# Altium schematic sheet 0172_IMVP VCCCORE_SOC_ .SchDoc
size 848 x 558 mm
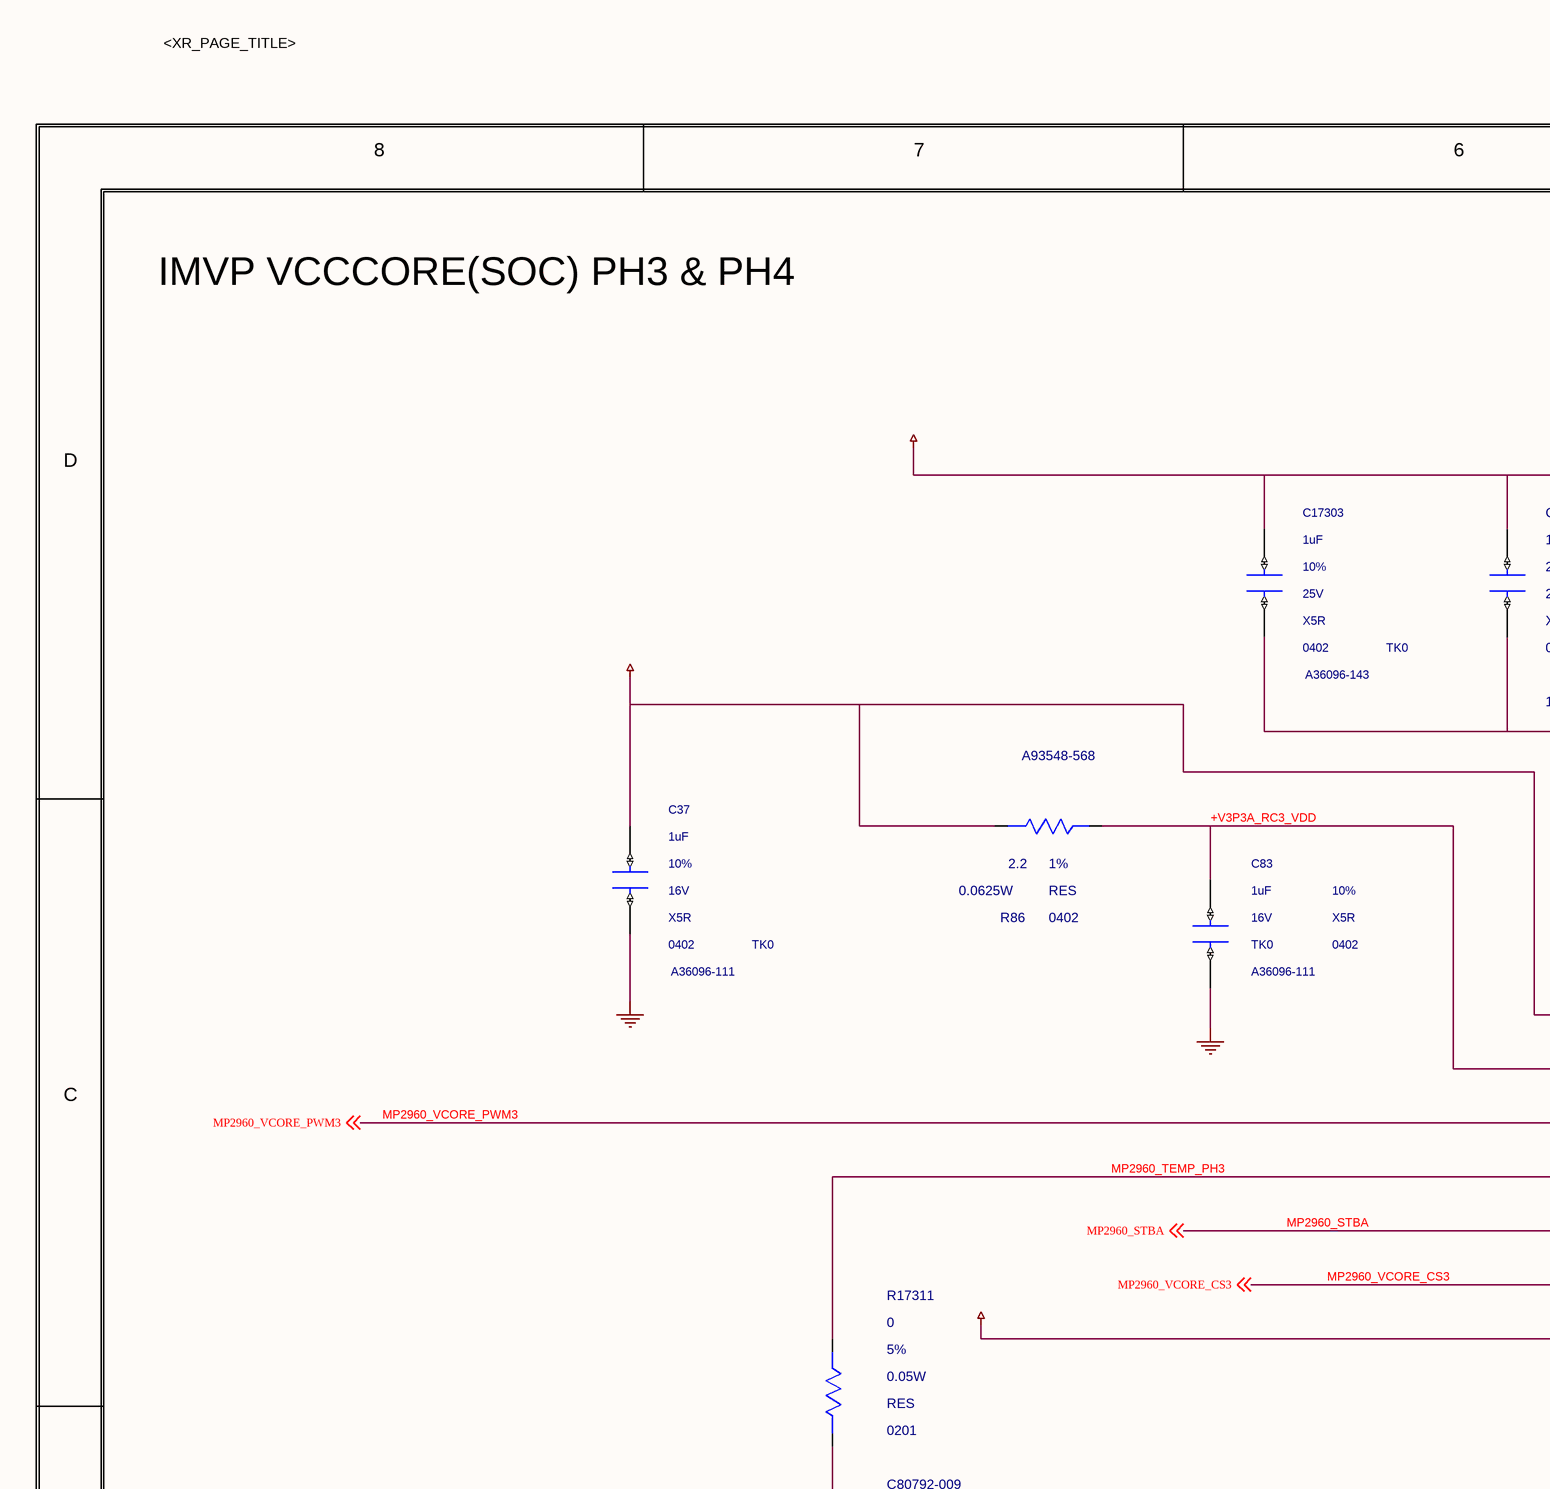
[diagram p0: 0172_IMVP VCCCORE_SOC_ .SchDoc, top left]
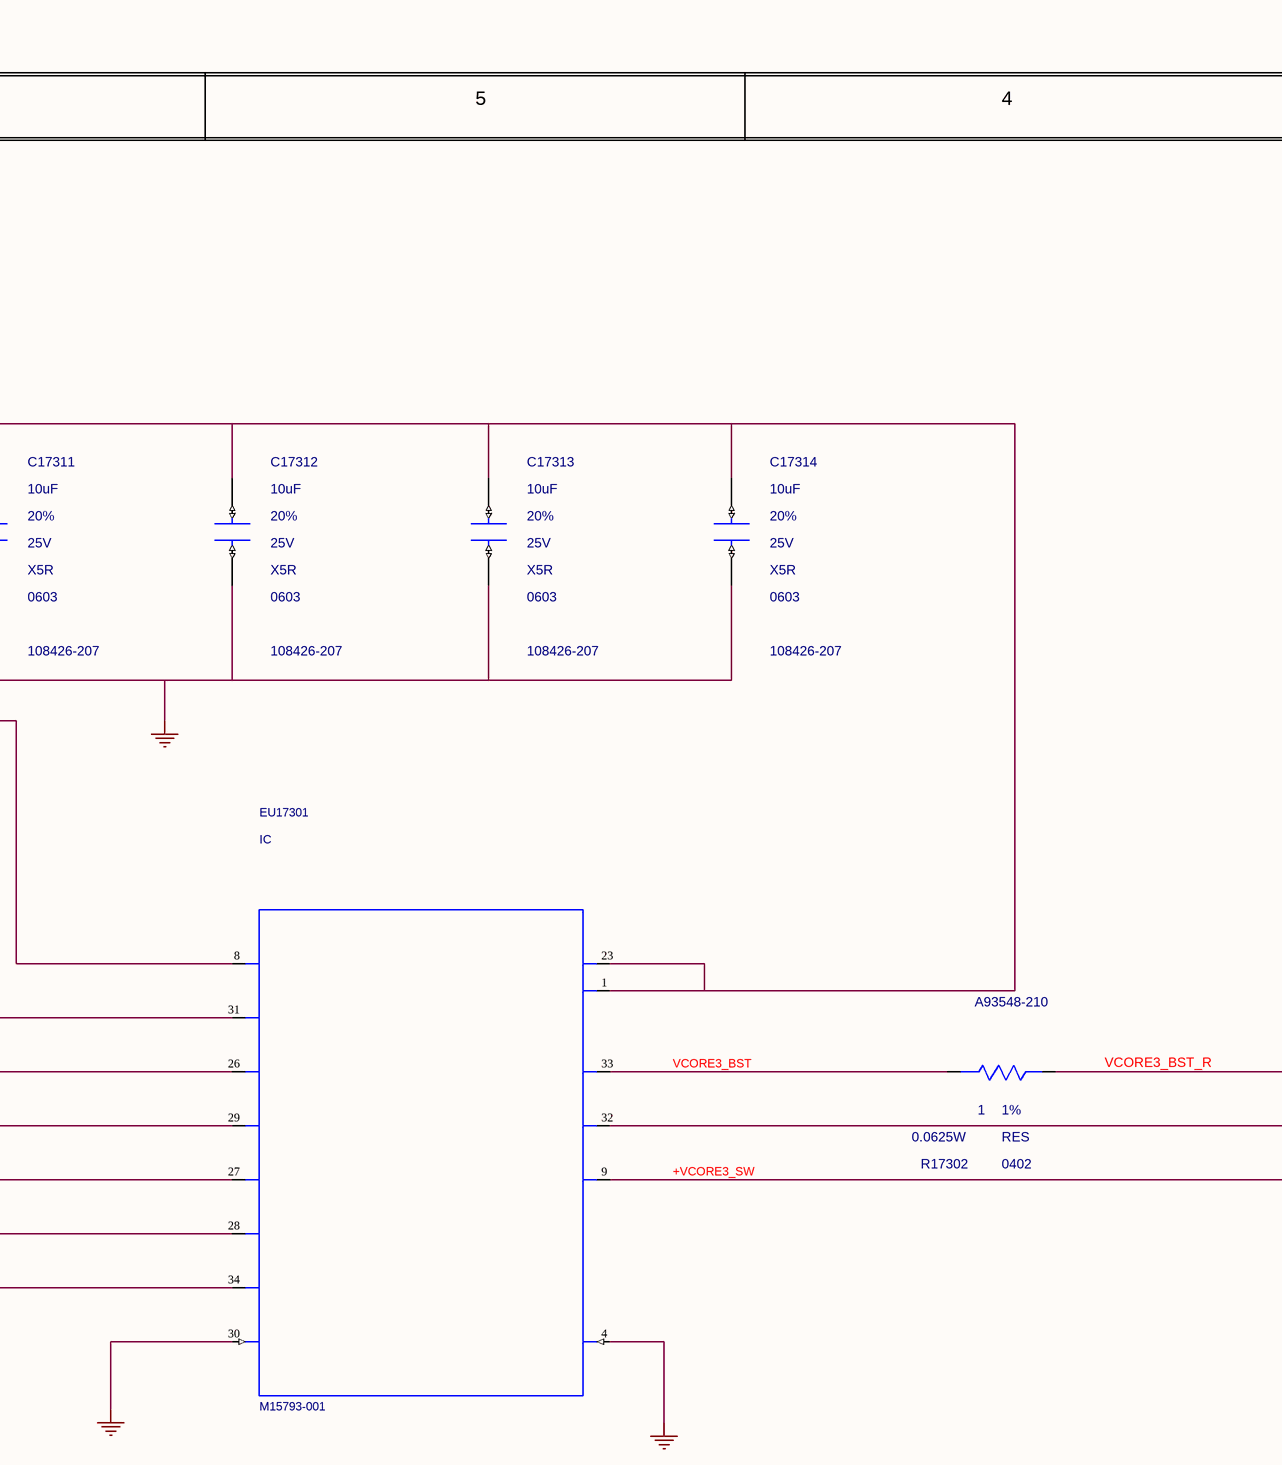
[diagram p1: 0172_IMVP VCCCORE_SOC_ .SchDoc, top middle]
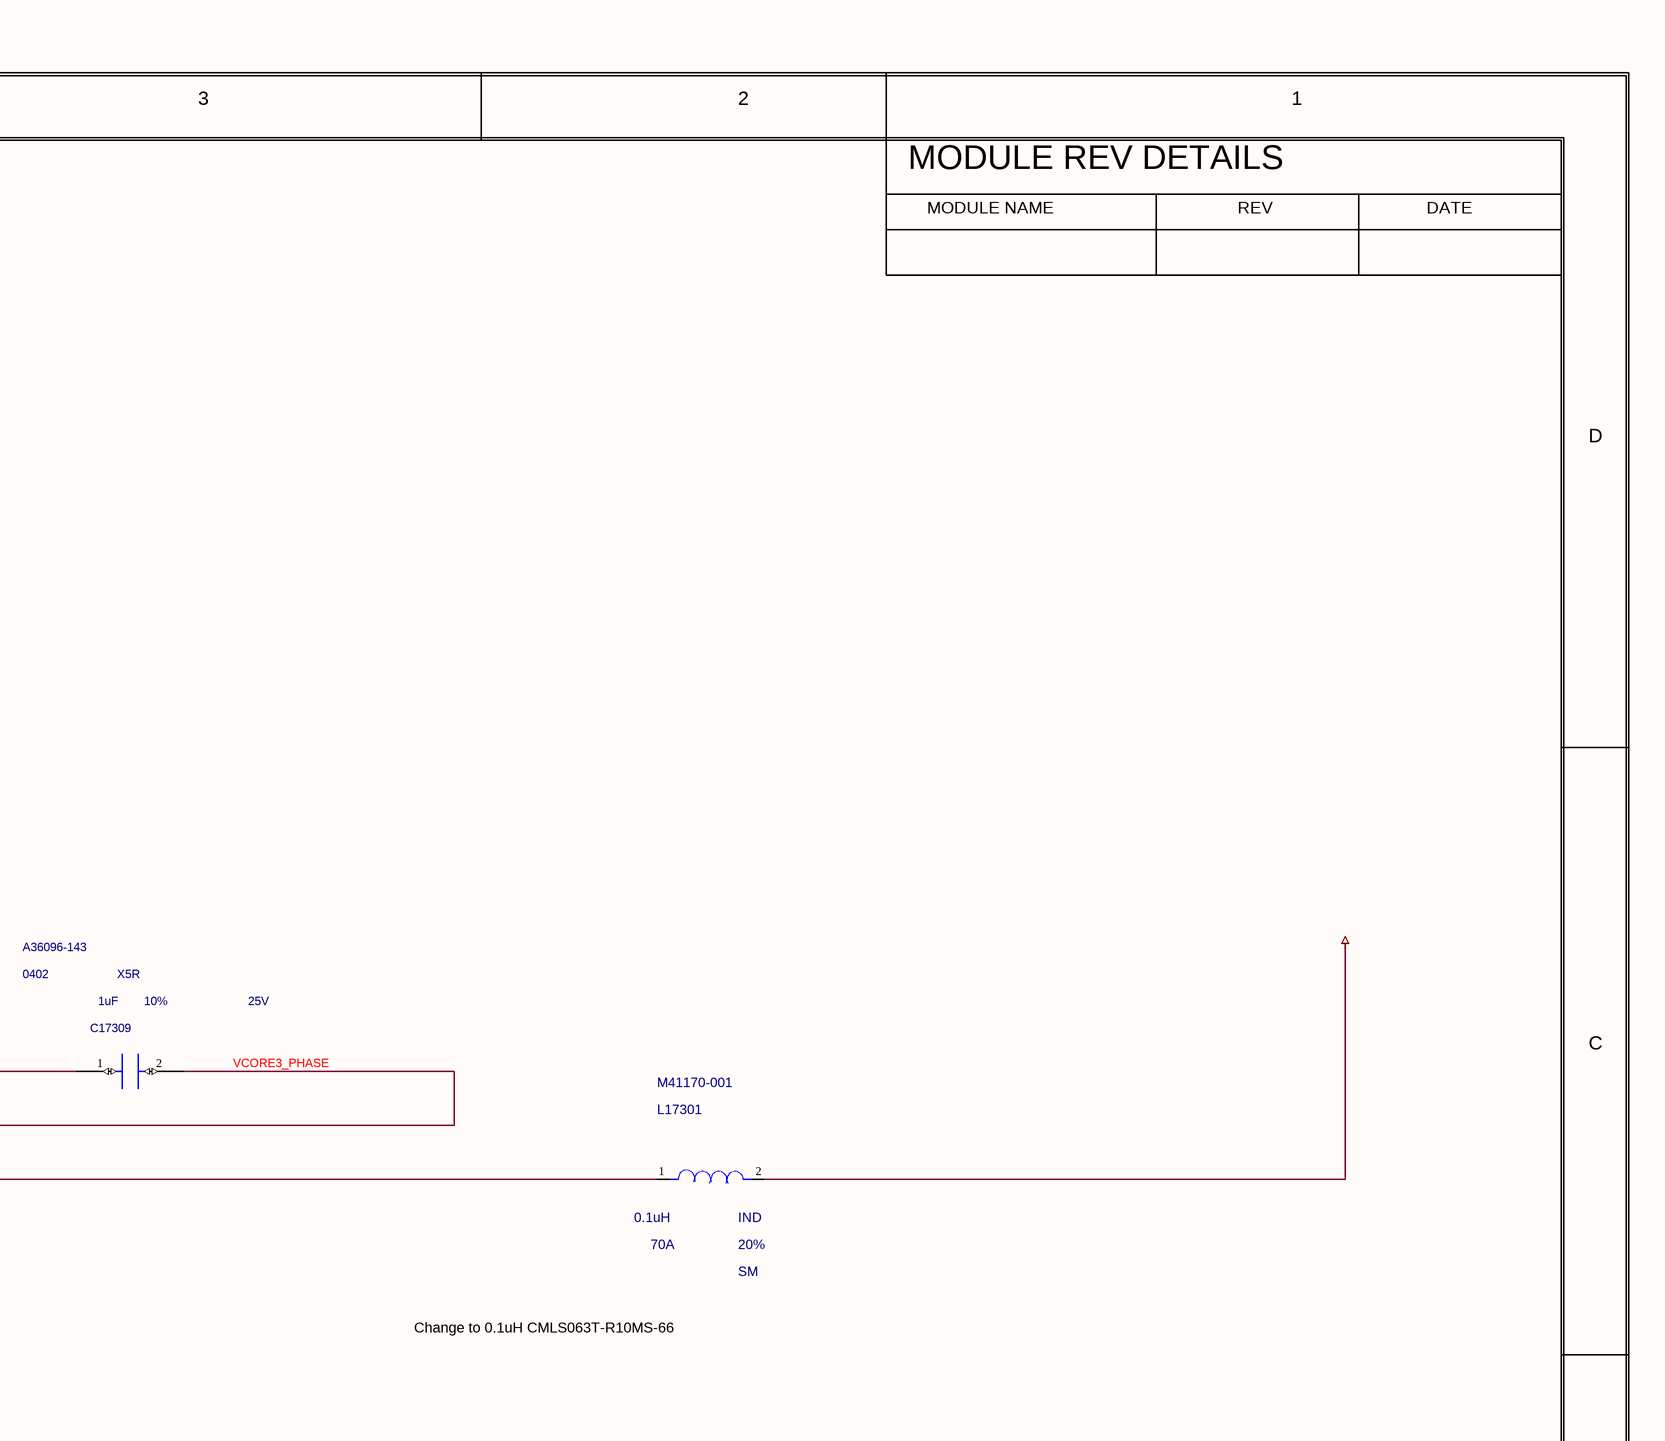
[diagram p2: 0172_IMVP VCCCORE_SOC_ .SchDoc, top right]
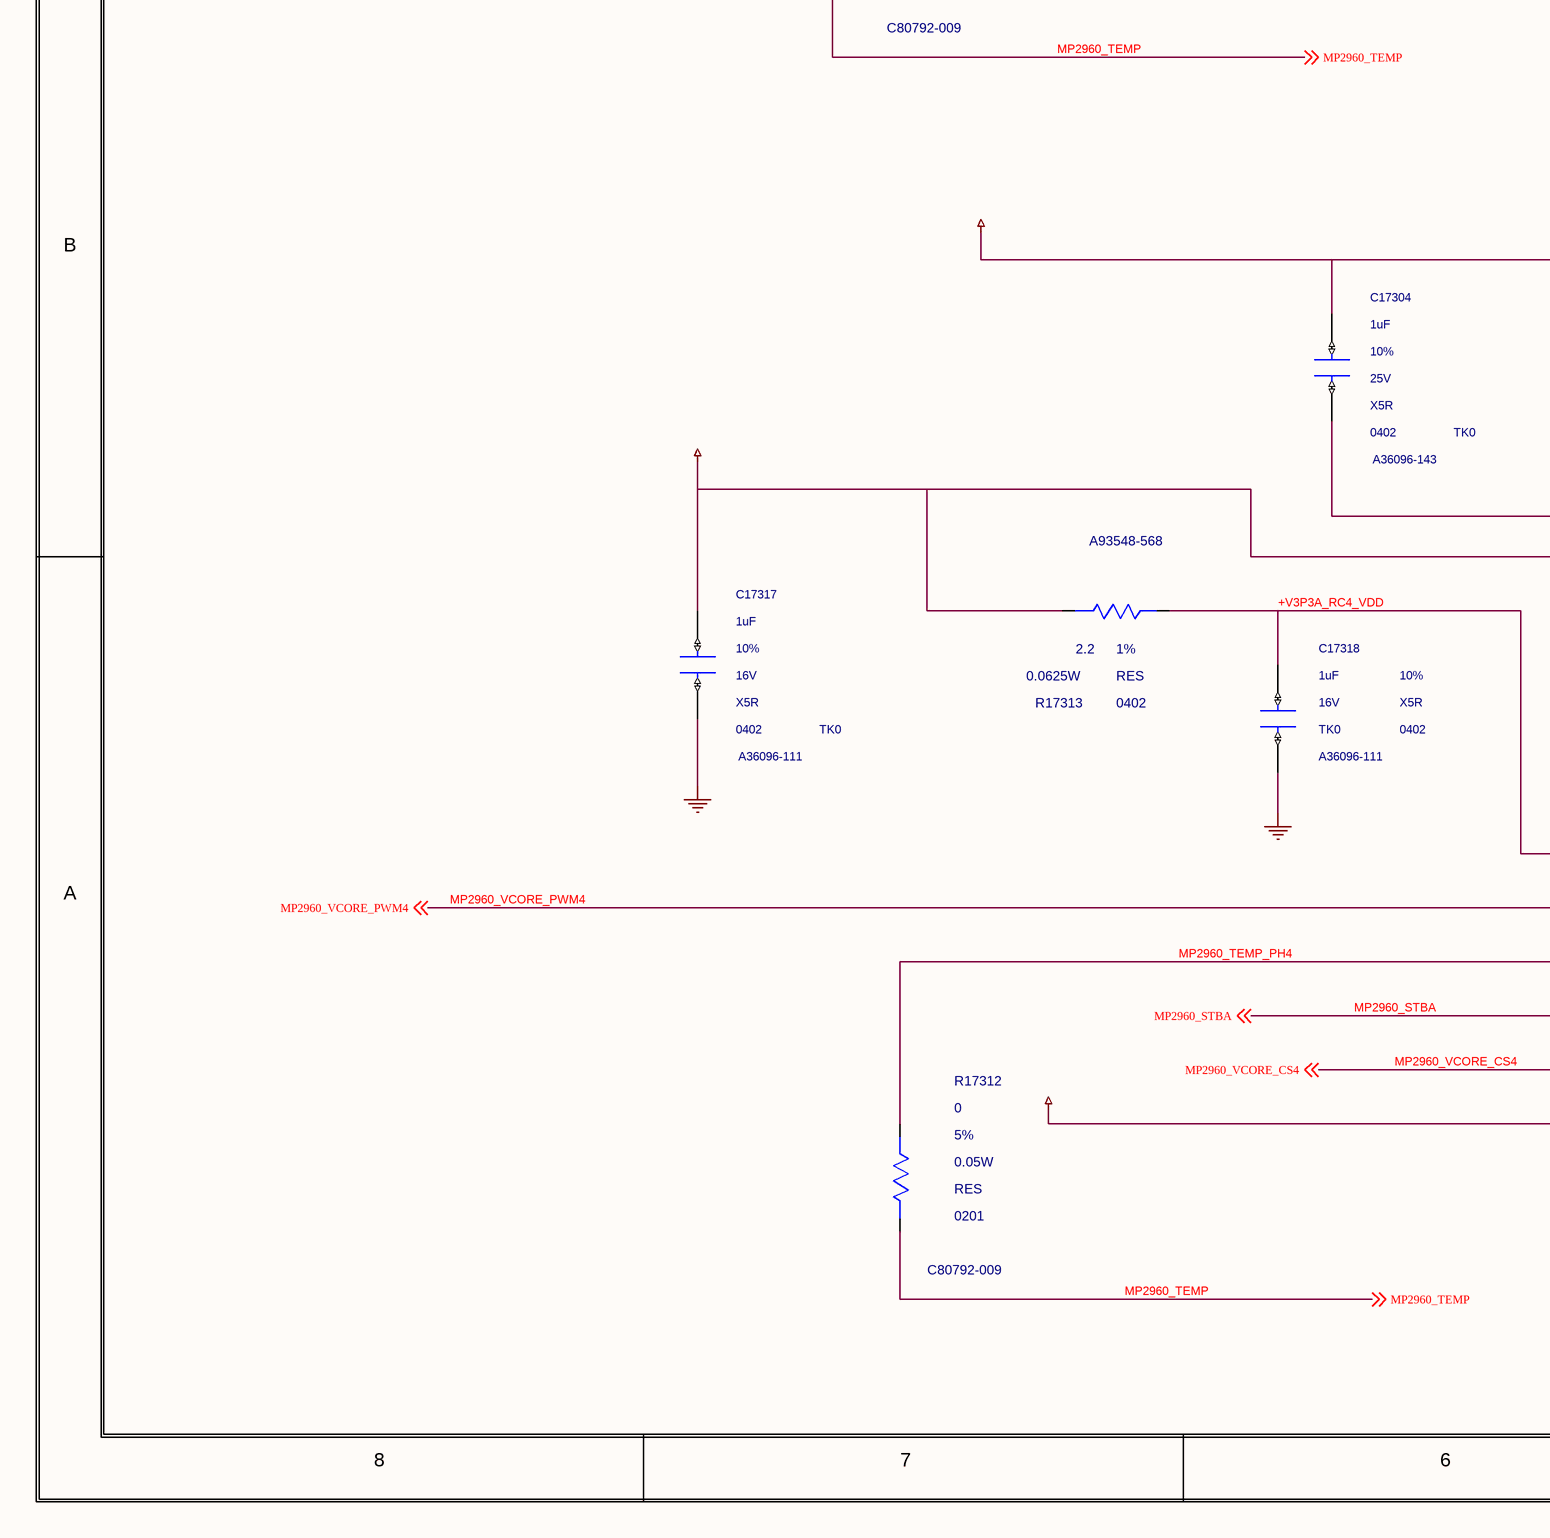
[diagram p3: 0172_IMVP VCCCORE_SOC_ .SchDoc, bottom left]
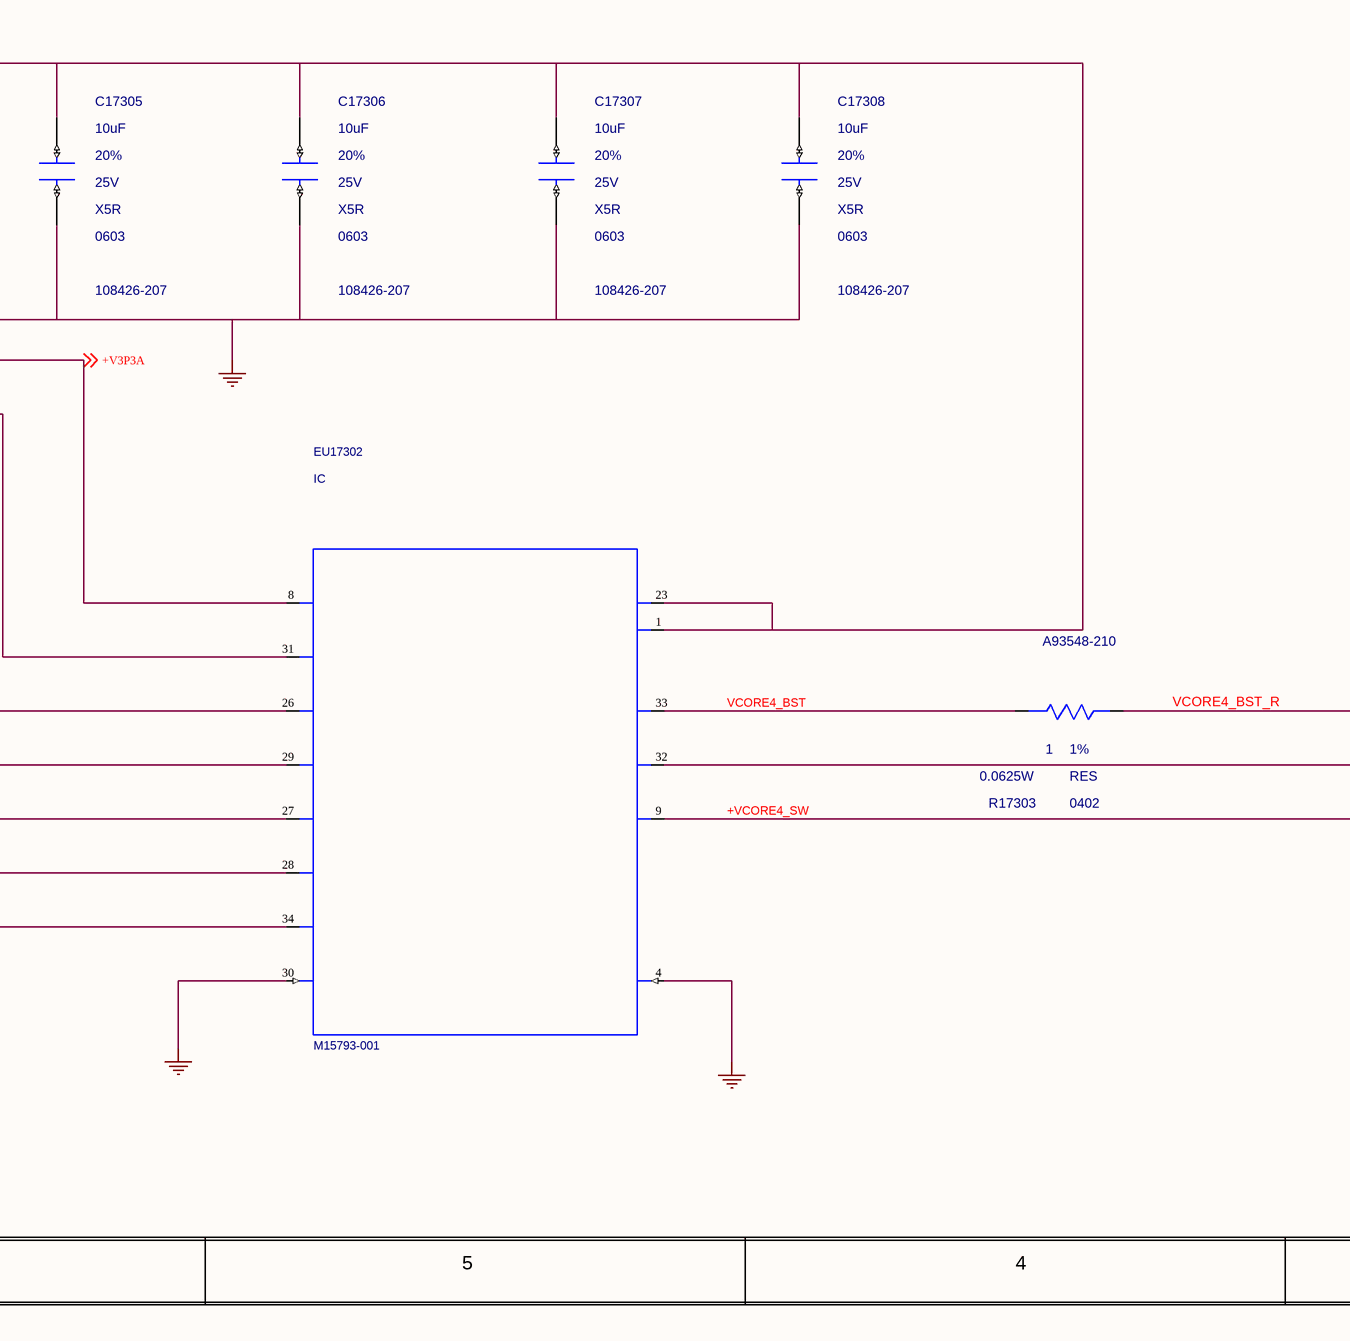
[diagram p4: 0172_IMVP VCCCORE_SOC_ .SchDoc, bottom middle]
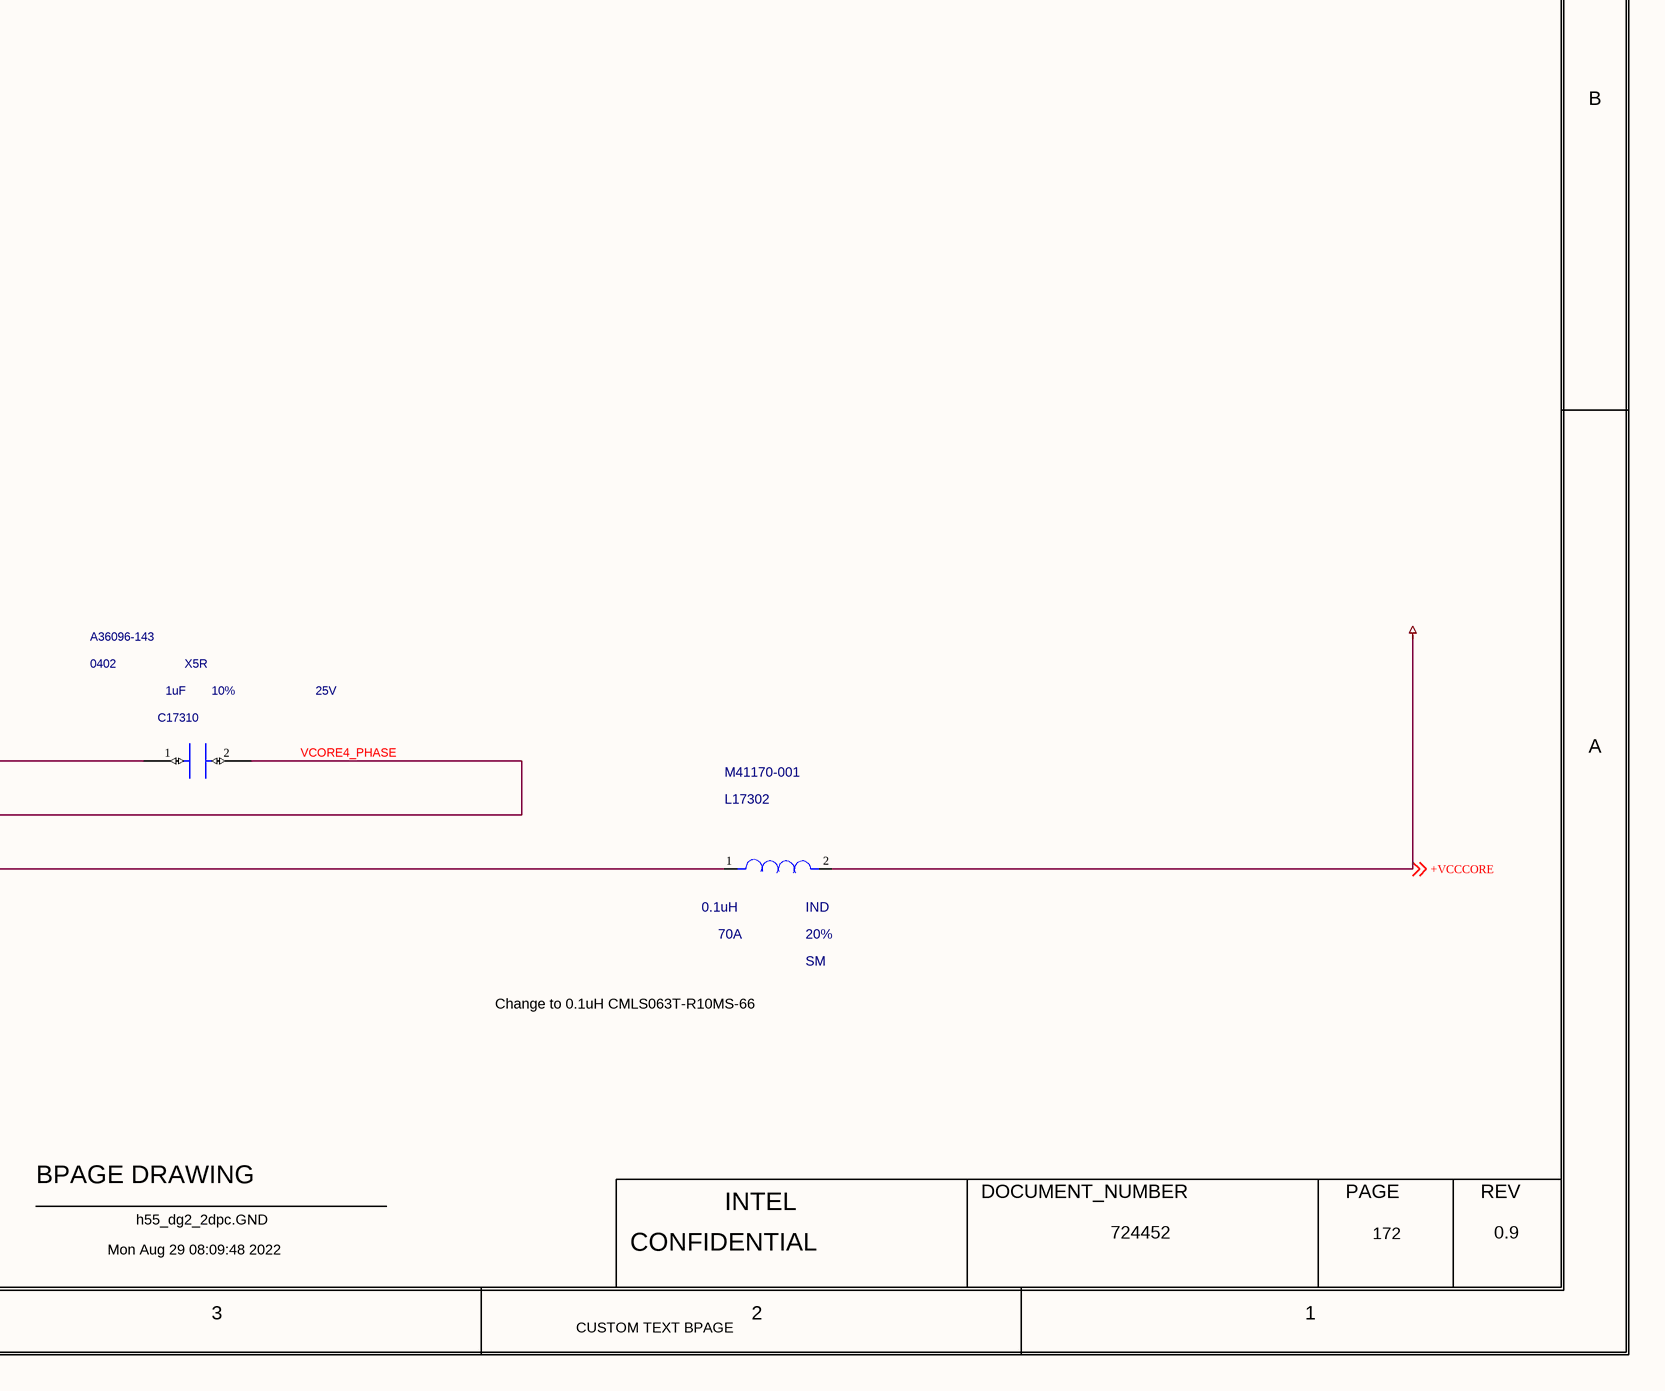
[diagram p5: 0172_IMVP VCCCORE_SOC_ .SchDoc, bottom right]

## Parts
C37  1uF  FP_TECH: TK0  MATERIAL: X5R  PACK_TYPE: 0402  PART_NUMBER: A36096-111  TOLERANCE: 10%  VOLTAGE: 16V  [CTK0_SM0402_1050X550_MA]
C83  1uF  FP_TECH: TK0  MATERIAL: X5R  PACK_TYPE: 0402  PART_NUMBER: A36096-111  TOLERANCE: 10%  VOLTAGE: 16V  [CTK0_SM0402_1050X550_MA]
C17303  1uF  FP_TECH: TK0  MATERIAL: X5R  PACK_TYPE: 0402  PART_NUMBER: A36096-143  TOLERANCE: 10%  VOLTAGE: 25V  [CTK0_SM0402_1050X550_MA]
C17304  1uF  FP_TECH: TK0  MATERIAL: X5R  PACK_TYPE: 0402  PART_NUMBER: A36096-143  TOLERANCE: 10%  VOLTAGE: 25V  [CTK0_SM0402_1050X550_MA]
C17305  10uF  MATERIAL: X5R  PACK_TYPE: 0603  PART_NUMBER: 108426-207  TOLERANCE: 20%  VOLTAGE: 25V  [CTK2_SM0603_1800X1000_MA]
C17306  10uF  MATERIAL: X5R  PACK_TYPE: 0603  PART_NUMBER: 108426-207  TOLERANCE: 20%  VOLTAGE: 25V  [CTK2_SM0603_1800X1000_MA]
C17307  10uF  MATERIAL: X5R  PACK_TYPE: 0603  PART_NUMBER: 108426-207  TOLERANCE: 20%  VOLTAGE: 25V  [CTK2_SM0603_1800X1000_MA]
C17308  10uF  MATERIAL: X5R  PACK_TYPE: 0603  PART_NUMBER: 108426-207  TOLERANCE: 20%  VOLTAGE: 25V  [CTK2_SM0603_1800X1000_MA]
C17309  1uF  MATERIAL: X5R  PACK_TYPE: 0402  PART_NUMBER: A36096-143  TOLERANCE: 10%  VOLTAGE: 25V  [SMC0402MA]
C17310  1uF  MATERIAL: X5R  PACK_TYPE: 0402  PART_NUMBER: A36096-143  TOLERANCE: 10%  VOLTAGE: 25V  [SMC0402MA]
C17311  10uF  MATERIAL: X5R  PACK_TYPE: 0603  PART_NUMBER: 108426-207  TOLERANCE: 20%  VOLTAGE: 25V  [CTK2_SM0603_1800X1000_MA]
C17312  10uF  MATERIAL: X5R  PACK_TYPE: 0603  PART_NUMBER: 108426-207  TOLERANCE: 20%  VOLTAGE: 25V  [CTK2_SM0603_1800X1000_MA]
C17313  10uF  MATERIAL: X5R  PACK_TYPE: 0603  PART_NUMBER: 108426-207  TOLERANCE: 20%  VOLTAGE: 25V  [CTK2_SM0603_1800X1000_MA]
C17314  10uF  MATERIAL: X5R  PACK_TYPE: 0603  PART_NUMBER: 108426-207  TOLERANCE: 20%  VOLTAGE: 25V  [CTK2_SM0603_1800X1000_MA]
C17317  1uF  FP_TECH: TK0  MATERIAL: X5R  PACK_TYPE: 0402  PART_NUMBER: A36096-111  TOLERANCE: 10%  VOLTAGE: 16V  [CTK0_SM0402_1050X550_MA]
C17318  1uF  FP_TECH: TK0  MATERIAL: X5R  PACK_TYPE: 0402  PART_NUMBER: A36096-111  TOLERANCE: 10%  VOLTAGE: 16V  [CTK0_SM0402_1050X550_MA]
EU17301  MATERIAL: IC  PART_NUMBER: M15793-001  [CTK1_LCC34_4100X6100_450_DF4P_MA_VR]  (hidden comment: C_MP86959)
EU17302  MATERIAL: IC  PART_NUMBER: M15793-001  [CTK1_LCC34_4100X6100_450_DF4P_MA_VR]  (hidden comment: C_MP86959)
L17301  0.1uH  CURRENT: 70A  MATERIAL: IND  PACK_TYPE: SM  PART_NUMBER: M41170-001  TOLERANCE: 20%  [CTK2_SM_7300X6800_MA]
L17302  0.1uH  CURRENT: 70A  MATERIAL: IND  PACK_TYPE: SM  PART_NUMBER: M41170-001  TOLERANCE: 20%  [CTK2_SM_7300X6800_MA]
R86  2.2  MATERIAL: RES  PACK_TYPE: 0402  PART_NUMBER: A93548-568  TOLERANCE: 1%  WATTAGE: 0.0625W  [CTK2_SM0402_1100X550_MA]
R17302  1  MATERIAL: RES  PACK_TYPE: 0402  PART_NUMBER: A93548-210  TOLERANCE: 1%  WATTAGE: 0.0625W  [CTK0_SM0402_1100X550_MA]
R17303  1  MATERIAL: RES  PACK_TYPE: 0402  PART_NUMBER: A93548-210  TOLERANCE: 1%  WATTAGE: 0.0625W  [CTK0_SM0402_1100X550_MA]
R17311  0  MATERIAL: RES  PACK_TYPE: 0201  PART_NUMBER: C80792-009  TOLERANCE: 5%  WATTAGE: 0.05W  [CTK0_SM0201_630X330_MA]
R17312  0  MATERIAL: RES  PACK_TYPE: 0201  PART_NUMBER: C80792-009  TOLERANCE: 5%  WATTAGE: 0.05W  [CTK0_SM0201_630X330_MA]
R17313  2.2  MATERIAL: RES  PACK_TYPE: 0402  PART_NUMBER: A93548-568  TOLERANCE: 1%  WATTAGE: 0.0625W  [CTK2_SM0402_1100X550_MA]

## Nets
+V3P3A: C37.1(A) C17317.1(A) EU17301.8(VDRV) EU17301.34(TEST) EU17302.8(VDRV) EU17302.34(TEST) R86.1(A) R17313.1(A) ; off-sheet +V3P3A
+VBATA_VCCIN: C17303.1(A) C17304.1(A) C17305.1(A) C17306.1(A) C17307.1(A) C17308.1(A) C17311.1(A) C17312.1(A) C17313.1(A) C17314.1(A) EU17301.1(VIN_1) EU17301.23(VIN_2) EU17302.1(VIN_1) EU17302.23(VIN_2)
+VCCCORE: L17301.2(INB) L17302.2(INB) ; off-sheet +VCCCORE
GND: C37.2(B) C83.2(B) C17303.2(B) C17304.2(B) C17305.2(B) C17306.2(B) C17307.2(B) C17308.2(B) C17311.2(B) C17312.2(B) C17313.2(B) C17314.2(B) C17317.2(B) C17318.2(B) EU17301.4(PGND) EU17301.30(AGND) EU17302.4(PGND) EU17302.30(AGND)
+V3P3A_RC3_VDD: C83.1(A) EU17301.31(VDD) R86.2(B)
+V3P3A_RC4_VDD: C17318.1(A) EU17302.31(VDD) R17313.2(B)
+VCORE3_SW: EU17301.9(SW) L17301.1(INA)
+VCORE4_SW: EU17302.9(SW) L17302.1(INA)
MP2960_STBA: EU17301.27(SYNC) EU17302.27(SYNC) ; off-sheet MP2960_STBA
MP2960_TEMP: R17311.2(B) R17312.2(B) ; off-sheet MP2960_TEMP
MP2960_TEMP_PH3: EU17301.29(VTEMP_FLT) R17311.1(A)
MP2960_TEMP_PH4: EU17302.29(VTEMP_FLT) R17312.1(A)
MP2960_VCORE_CS3: EU17301.28(CS) ; off-sheet MP2960_VCORE_CS3
MP2960_VCORE_CS4: EU17302.28(CS) ; off-sheet MP2960_VCORE_CS4
MP2960_VCORE_PWM3: EU17301.26(PWM) ; off-sheet MP2960_VCORE_PWM3
MP2960_VCORE_PWM4: EU17302.26(PWM) ; off-sheet MP2960_VCORE_PWM4
VCORE3_BST: EU17301.33(BST) R17302.1(A)
VCORE3_BST_R: C17309.1(A) R17302.2(B)
VCORE3_PHASE: C17309.2(B) EU17301.32(PHASE)
VCORE4_BST: EU17302.33(BST) R17303.1(A)
VCORE4_BST_R: C17310.1(A) R17303.2(B)
VCORE4_PHASE: C17310.2(B) EU17302.32(PHASE)

## Notes on the sheet
- <XR_PAGE_TITLE>
- 8
- 7
- 6
- 5
- 4
- 3
- 2
- 1
- MODULE REV DETAILS
- IMVP VCCCORE(SOC) PH3 & PH4
- MODULE NAME
- REV
- DATE
- D
- C
- Change to 0.1uH CMLS063T-R10MS-66
- B
- A
- BPAGE DRAWING
- INTEL
- DOCUMENT_NUMBER
- PAGE
- Mon Aug 29 08:09:48 2022
- h55_dg2_2dpc.GND
- CONFIDENTIAL
- 724452
- 172
- 0.9
- CUSTOM TEXT BPAGE

## Library data of the parts
C37 = C_CAP: CDS_PHYS_PART_NAME: C_CAP_0402-A36096-111,X5R,1UF,16V,10%,TK0,GENERIC; CDS_LMAN_SYM_OUTLINE: -50,50,50,-50; IP: GENERIC; ROOM: NONE; OriginalSymbolOrigin: (-50,25); XY: (-1625,2675); VER: 1; ROT: 0; PHYS_PAGE: 172; LOCATION: C37; DRAWING: @RVP1_ADL_SB_ADP_S_DDR5_SODIMM_2DPC_LIB.H55_DG2_2DPC(SCH_1):PAGE541; CDS_LIB: c_discrete; VARIANT: ?; PCB Footprint: CTK0_SM0402_1050X550_MA; CHIPS_PART_NAME: C_CAP; CDS_PART_NAME: C_CAP_0402-A36096-111,X5R,1UF,16V,10%,TK0,GENERIC; CDS_LOCATION: C37
C83 = C_CAP: CDS_PHYS_PART_NAME: C_CAP_0402-A36096-111,X5R,1UF,16V,10%,TK0,GENERIC; CDS_LMAN_SYM_OUTLINE: -50,50,50,-50; IP: GENERIC; ROOM: NONE; OriginalSymbolOrigin: (-50,25); XY: (-550,2575); VER: 1; ROT: 0; PHYS_PAGE: 172; LOCATION: C83; DRAWING: @RVP1_ADL_SB_ADP_S_DDR5_SODIMM_2DPC_LIB.H55_DG2_2DPC(SCH_1):PAGE541; CDS_LIB: c_discrete; VARIANT: ?; PCB Footprint: CTK0_SM0402_1050X550_MA; CHIPS_PART_NAME: C_CAP; CDS_PART_NAME: C_CAP_0402-A36096-111,X5R,1UF,16V,10%,TK0,GENERIC; CDS_LOCATION: C83
C17303 = C_CAP: CDS_PHYS_PART_NAME: C_CAP_0402-A36096-143,X5R,1UF,25V,10%,TK0,GENERIC; CDS_LMAN_SYM_OUTLINE: -50,50,50,-50; IP: GENERIC; ROOM: NONE; OriginalSymbolOrigin: (-50,25); XY: (-450,3225); VER: 1; ROT: 0; PHYS_PAGE: 172; LOCATION: C17303; DRAWING: @RVP1_ADL_SB_ADP_S_DDR5_SODIMM_2DPC_LIB.H55_DG2_2DPC(SCH_1):PAGE541; CDS_LIB: c_discrete; VARIANT: ?; PCB Footprint: CTK0_SM0402_1050X550_MA; CHIPS_PART_NAME: C_CAP; CDS_PART_NAME: C_CAP_0402-A36096-143,X5R,1UF,25V,10%,TK0,GENERIC; CDS_LOCATION: C17303
C17304 = C_CAP: CDS_PHYS_PART_NAME: C_CAP_0402-A36096-143,X5R,1UF,25V,10%,TK0,GENERIC; CDS_LMAN_SYM_OUTLINE: -50,50,50,-50; IP: GENERIC; ROOM: NONE; OriginalSymbolOrigin: (-50,25); XY: (-325,925); VER: 1; ROT: 0; PHYS_PAGE: 172; LOCATION: C17304; DRAWING: @RVP1_ADL_SB_ADP_S_DDR5_SODIMM_2DPC_LIB.H55_DG2_2DPC(SCH_1):PAGE541; CDS_LIB: c_discrete; VARIANT: ?; PCB Footprint: CTK0_SM0402_1050X550_MA; CHIPS_PART_NAME: C_CAP; CDS_PART_NAME: C_CAP_0402-A36096-143,X5R,1UF,25V,10%,TK0,GENERIC; CDS_LOCATION: C17304
C17305 = C_CAP: CDS_PHYS_PART_NAME: C_CAP_0603-108426-207,X5R,10UF,25V,20%,TK2,GENERIC; CDS_LMAN_SYM_OUTLINE: -50,50,50,-50; FP_TECH: TK2; IP: GENERIC; ROOM: NONE; OriginalSymbolOrigin: (-50,25); XY: (125,925); VER: 1; ROT: 0; PHYS_PAGE: 172; LOCATION: C17305; DRAWING: @RVP1_ADL_SB_ADP_S_DDR5_SODIMM_2DPC_LIB.H55_DG2_2DPC(SCH_1):PAGE541; CDS_LIB: c_discrete; VARIANT: ?; PCB Footprint: CTK2_SM0603_1800X1000_MA; CHIPS_PART_NAME: C_CAP; CDS_PART_NAME: C_CAP_0603-108426-207,X5R,10UF,25V,20%,TK2,GENERIC; CDS_LOCATION: C17305
C17306 = C_CAP: CDS_PHYS_PART_NAME: C_CAP_0603-108426-207,X5R,10UF,25V,20%,TK2,GENERIC; CDS_LMAN_SYM_OUTLINE: -50,50,50,-50; FP_TECH: TK2; IP: GENERIC; ROOM: NONE; OriginalSymbolOrigin: (-50,25); XY: (575,925); VER: 1; ROT: 0; PHYS_PAGE: 172; LOCATION: C17306; DRAWING: @RVP1_ADL_SB_ADP_S_DDR5_SODIMM_2DPC_LIB.H55_DG2_2DPC(SCH_1):PAGE541; CDS_LIB: c_discrete; VARIANT: ?; PCB Footprint: CTK2_SM0603_1800X1000_MA; CHIPS_PART_NAME: C_CAP; CDS_PART_NAME: C_CAP_0603-108426-207,X5R,10UF,25V,20%,TK2,GENERIC; CDS_LOCATION: C17306
C17307 = C_CAP: CDS_PHYS_PART_NAME: C_CAP_0603-108426-207,X5R,10UF,25V,20%,TK2,GENERIC; CDS_LMAN_SYM_OUTLINE: -50,50,50,-50; FP_TECH: TK2; IP: GENERIC; ROOM: NONE; OriginalSymbolOrigin: (-50,25); XY: (1050,925); VER: 1; ROT: 0; PHYS_PAGE: 172; LOCATION: C17307; DRAWING: @RVP1_ADL_SB_ADP_S_DDR5_SODIMM_2DPC_LIB.H55_DG2_2DPC(SCH_1):PAGE541; CDS_LIB: c_discrete; VARIANT: ?; PCB Footprint: CTK2_SM0603_1800X1000_MA; CHIPS_PART_NAME: C_CAP; CDS_PART_NAME: C_CAP_0603-108426-207,X5R,10UF,25V,20%,TK2,GENERIC; CDS_LOCATION: C17307
C17308 = C_CAP: CDS_PHYS_PART_NAME: C_CAP_0603-108426-207,X5R,10UF,25V,20%,TK2,GENERIC; CDS_LMAN_SYM_OUTLINE: -50,50,50,-50; FP_TECH: TK2; IP: GENERIC; ROOM: NONE; OriginalSymbolOrigin: (-50,25); XY: (1500,925); VER: 1; ROT: 0; PHYS_PAGE: 172; LOCATION: C17308; DRAWING: @RVP1_ADL_SB_ADP_S_DDR5_SODIMM_2DPC_LIB.H55_DG2_2DPC(SCH_1):PAGE541; CDS_LIB: c_discrete; VARIANT: ?; PCB Footprint: CTK2_SM0603_1800X1000_MA; CHIPS_PART_NAME: C_CAP; CDS_PART_NAME: C_CAP_0603-108426-207,X5R,10UF,25V,20%,TK2,GENERIC; CDS_LOCATION: C17308
C17309 = CAP#1: CHIPS_PART_NAME: CAP; CDS_PHYS_PART_NAME: CAP_0402-A36096-143,X5R,1UF,25V,10%,LPDB,GENERIC; OriginalSymbolOrigin: (-25,50); XY: (2750,2225); VER: 2; ROT: 0; PHYS_PAGE: 172; LOCATION: C17309; DRAWING: @RVP1_ADL_SB_ADP_S_DDR5_SODIMM_2DPC_LIB.H55_DG2_2DPC(SCH_1):PAGE541; CDS_LIB: discrete; PCB Footprint: SMC0402MA; CDS_PART_NAME: CAP_0402-A36096-143,X5R,1UF,25V,10%,LPDB,GENERIC; CDS_LOCATION: C17309
C17310 = CAP#1: CHIPS_PART_NAME: CAP; CDS_PHYS_PART_NAME: CAP_0402-A36096-143,X5R,1UF,25V,10%,LPDB,GENERIC; OriginalSymbolOrigin: (-25,50); XY: (2875,-75); VER: 2; ROT: 0; PHYS_PAGE: 172; LOCATION: C17310; DRAWING: @RVP1_ADL_SB_ADP_S_DDR5_SODIMM_2DPC_LIB.H55_DG2_2DPC(SCH_1):PAGE541; CDS_LIB: discrete; PCB Footprint: SMC0402MA; CDS_PART_NAME: CAP_0402-A36096-143,X5R,1UF,25V,10%,LPDB,GENERIC; CDS_LOCATION: C17310
C17311 = C_CAP: CDS_PHYS_PART_NAME: C_CAP_0603-108426-207,X5R,10UF,25V,20%,TK2,GENERIC; CDS_LMAN_SYM_OUTLINE: -50,50,50,-50; FP_TECH: TK2; IP: GENERIC; ROOM: NONE; OriginalSymbolOrigin: (-50,25); XY: (0,3225); VER: 1; ROT: 0; PHYS_PAGE: 172; LOCATION: C17311; DRAWING: @RVP1_ADL_SB_ADP_S_DDR5_SODIMM_2DPC_LIB.H55_DG2_2DPC(SCH_1):PAGE541; CDS_LIB: c_discrete; VARIANT: ?; PCB Footprint: CTK2_SM0603_1800X1000_MA; CHIPS_PART_NAME: C_CAP; CDS_PART_NAME: C_CAP_0603-108426-207,X5R,10UF,25V,20%,TK2,GENERIC; CDS_LOCATION: C17311
C17312 = C_CAP: CDS_PHYS_PART_NAME: C_CAP_0603-108426-207,X5R,10UF,25V,20%,TK2,GENERIC; CDS_LMAN_SYM_OUTLINE: -50,50,50,-50; FP_TECH: TK2; IP: GENERIC; ROOM: NONE; OriginalSymbolOrigin: (-50,25); XY: (450,3225); VER: 1; ROT: 0; PHYS_PAGE: 172; LOCATION: C17312; DRAWING: @RVP1_ADL_SB_ADP_S_DDR5_SODIMM_2DPC_LIB.H55_DG2_2DPC(SCH_1):PAGE541; CDS_LIB: c_discrete; VARIANT: ?; PCB Footprint: CTK2_SM0603_1800X1000_MA; CHIPS_PART_NAME: C_CAP; CDS_PART_NAME: C_CAP_0603-108426-207,X5R,10UF,25V,20%,TK2,GENERIC; CDS_LOCATION: C17312
C17313 = C_CAP: CDS_PHYS_PART_NAME: C_CAP_0603-108426-207,X5R,10UF,25V,20%,TK2,GENERIC; CDS_LMAN_SYM_OUTLINE: -50,50,50,-50; FP_TECH: TK2; IP: GENERIC; ROOM: NONE; OriginalSymbolOrigin: (-50,25); XY: (925,3225); VER: 1; ROT: 0; PHYS_PAGE: 172; LOCATION: C17313; DRAWING: @RVP1_ADL_SB_ADP_S_DDR5_SODIMM_2DPC_LIB.H55_DG2_2DPC(SCH_1):PAGE541; CDS_LIB: c_discrete; VARIANT: ?; PCB Footprint: CTK2_SM0603_1800X1000_MA; CHIPS_PART_NAME: C_CAP; CDS_PART_NAME: C_CAP_0603-108426-207,X5R,10UF,25V,20%,TK2,GENERIC; CDS_LOCATION: C17313
C17314 = C_CAP: CDS_PHYS_PART_NAME: C_CAP_0603-108426-207,X5R,10UF,25V,20%,TK2,GENERIC; CDS_LMAN_SYM_OUTLINE: -50,50,50,-50; FP_TECH: TK2; IP: GENERIC; ROOM: NONE; OriginalSymbolOrigin: (-50,25); XY: (1375,3225); VER: 1; ROT: 0; PHYS_PAGE: 172; LOCATION: C17314; DRAWING: @RVP1_ADL_SB_ADP_S_DDR5_SODIMM_2DPC_LIB.H55_DG2_2DPC(SCH_1):PAGE541; CDS_LIB: c_discrete; VARIANT: ?; PCB Footprint: CTK2_SM0603_1800X1000_MA; CHIPS_PART_NAME: C_CAP; CDS_PART_NAME: C_CAP_0603-108426-207,X5R,10UF,25V,20%,TK2,GENERIC; CDS_LOCATION: C17314
C17317 = C_CAP: CDS_PHYS_PART_NAME: C_CAP_0402-A36096-111,X5R,1UF,16V,10%,TK0,GENERIC; CDS_LMAN_SYM_OUTLINE: -50,50,50,-50; IP: GENERIC; ROOM: NONE; OriginalSymbolOrigin: (-50,25); XY: (-1500,375); VER: 1; ROT: 0; PHYS_PAGE: 172; LOCATION: C17317; DRAWING: @RVP1_ADL_SB_ADP_S_DDR5_SODIMM_2DPC_LIB.H55_DG2_2DPC(SCH_1):PAGE541; CDS_LIB: c_discrete; VARIANT: ?; PCB Footprint: CTK0_SM0402_1050X550_MA; CHIPS_PART_NAME: C_CAP; CDS_PART_NAME: C_CAP_0402-A36096-111,X5R,1UF,16V,10%,TK0,GENERIC; CDS_LOCATION: C17317
C17318 = C_CAP: CDS_PHYS_PART_NAME: C_CAP_0402-A36096-111,X5R,1UF,16V,10%,TK0,GENERIC; CDS_LMAN_SYM_OUTLINE: -50,50,50,-50; IP: GENERIC; ROOM: NONE; OriginalSymbolOrigin: (-50,25); XY: (-425,275); VER: 1; ROT: 0; PHYS_PAGE: 172; LOCATION: C17318; DRAWING: @RVP1_ADL_SB_ADP_S_DDR5_SODIMM_2DPC_LIB.H55_DG2_2DPC(SCH_1):PAGE541; CDS_LIB: c_discrete; VARIANT: ?; PCB Footprint: CTK0_SM0402_1050X550_MA; CHIPS_PART_NAME: C_CAP; CDS_PART_NAME: C_CAP_0402-A36096-111,X5R,1UF,16V,10%,TK0,GENERIC; CDS_LOCATION: C17318
EU17301 = C_MP86959: CDS_PHYS_PART_NAME: C_MP86959_LCC-M15793-001,IC,MP86959GMW,TK1,GENERIC; CDS_LMAN_SYM_OUTLINE: -300,450,300,-450; FP_TECH: TK1; IP: GENERIC; PACK_TYPE: LCC; ROOM: NONE; OriginalSymbolOrigin: (-325,450); XY: (800,2075); VER: 1; ROT: 0; PHYS_PAGE: 172; LOCATION: EU17301; DRAWING: @RVP1_ADL_SB_ADP_S_DDR5_SODIMM_2DPC_LIB.H55_DG2_2DPC(SCH_1):PAGE541; CDS_LIB: local; VARIANT: ?; PCB Footprint: CTK1_LCC34_4100X6100_450_DF4P_MA_VR; SEC_TYPE: LCC; CHIPS_PART_NAME: C_MP86959; CDS_PART_NAME: C_MP86959_LCC-M15793-001,IC,MP86959GMW,TK1,GENERIC; CDS_LOCATION: EU17301
EU17302 = C_MP86959: CDS_PHYS_PART_NAME: C_MP86959_LCC-M15793-001,IC,MP86959GMW,TK1,GENERIC; CDS_LMAN_SYM_OUTLINE: -300,450,300,-450; FP_TECH: TK1; IP: GENERIC; PACK_TYPE: LCC; ROOM: NONE; OriginalSymbolOrigin: (-325,450); XY: (900,-225); VER: 1; ROT: 0; PHYS_PAGE: 172; LOCATION: EU17302; DRAWING: @RVP1_ADL_SB_ADP_S_DDR5_SODIMM_2DPC_LIB.H55_DG2_2DPC(SCH_1):PAGE541; CDS_LIB: local; VARIANT: ?; PCB Footprint: CTK1_LCC34_4100X6100_450_DF4P_MA_VR; SEC_TYPE: LCC; CHIPS_PART_NAME: C_MP86959; CDS_PART_NAME: C_MP86959_LCC-M15793-001,IC,MP86959GMW,TK1,GENERIC; CDS_LOCATION: EU17302
L17301 = C_INDUCTOR: CDS_PHYS_PART_NAME: C_INDUCTOR_SM-M41170-001,IND,0.1UH,20%,70A,TK2,GENERIC; CDS_LMAN_SYM_OUTLINE: -100,50,100,-50; FP_TECH: TK2; IP: GENERIC; ROOM: NONE; OriginalSymbolOrigin: (-75,25); XY: (3825,2025); VER: 1; ROT: 0; PHYS_PAGE: 172; LOCATION: L17301; DRAWING: @RVP1_ADL_SB_ADP_S_DDR5_SODIMM_2DPC_LIB.H55_DG2_2DPC(SCH_1):PAGE541; CDS_LIB: local; VARIANT: ?; PCB Footprint: CTK2_SM_7300X6800_MA; CHIPS_PART_NAME: C_INDUCTOR; CDS_PART_NAME: C_INDUCTOR_SM-M41170-001,IND,0.1UH,20%,70A,TK2,GENERIC; CDS_LOCATION: L17301
L17302 = C_INDUCTOR: CDS_PHYS_PART_NAME: C_INDUCTOR_SM-M41170-001,IND,0.1UH,20%,70A,TK2,GENERIC; CDS_LMAN_SYM_OUTLINE: -100,50,100,-50; FP_TECH: TK2; IP: GENERIC; ROOM: NONE; OriginalSymbolOrigin: (-75,25); XY: (3950,-275); VER: 1; ROT: 0; PHYS_PAGE: 172; LOCATION: L17302; DRAWING: @RVP1_ADL_SB_ADP_S_DDR5_SODIMM_2DPC_LIB.H55_DG2_2DPC(SCH_1):PAGE541; CDS_LIB: local; VARIANT: ?; PCB Footprint: CTK2_SM_7300X6800_MA; CHIPS_PART_NAME: C_INDUCTOR; CDS_PART_NAME: C_INDUCTOR_SM-M41170-001,IND,0.1UH,20%,70A,TK2,GENERIC; CDS_LOCATION: L17302
R86 = C_RES#1: CHIPS_PART_NAME: C_RES; CDS_PHYS_PART_NAME: C_RES_0402-A93548-568,RES,2.2,1%,0.0625W,TK2,GENERIC; CDS_LMAN_SYM_OUTLINE: -50,50,50,-50; FP_TECH: TK2; IP: GENERIC; ROOM: NONE; OriginalSymbolOrigin: (-75,25); XY: (-850,2775); VER: 1; ROT: 0; PHYS_PAGE: 172; LOCATION: R86; DRAWING: @RVP1_ADL_SB_ADP_S_DDR5_SODIMM_2DPC_LIB.H55_DG2_2DPC(SCH_1):PAGE541; CDS_LIB: c_discrete; VARIANT: ?; PCB Footprint: CTK2_SM0402_1100X550_MA; CDS_PART_NAME: C_RES_0402-A93548-568,RES,2.2,1%,0.0625W,TK2,GENERIC; CDS_LOCATION: R86
R17302 = C_RES#1: CHIPS_PART_NAME: C_RES; CDS_PHYS_PART_NAME: C_RES_0402-A93548-210,RES,1,1%,0.0625W,TK0,GENERIC; CDS_LMAN_SYM_OUTLINE: -50,50,50,-50; FP_TECH: TK0; IP: GENERIC; ROOM: NONE; OriginalSymbolOrigin: (-75,25); XY: (1875,2225); ROT: 0; PHYS_PAGE: 172; LOCATION: R17302; DRAWING: @RVP1_ADL_SB_ADP_S_DDR5_SODIMM_2DPC_LIB.H55_DG2_2DPC(SCH_1):PAGE541; CDS_LIB: c_discrete; VARIANT: ?; PCB Footprint: CTK0_SM0402_1100X550_MA; VER: 1; CDS_PART_NAME: C_RES_0402-A93548-210,RES,1,1%,0.0625W,TK0,GENERIC; CDS_LOCATION: R17302
R17303 = C_RES#1: CHIPS_PART_NAME: C_RES; CDS_PHYS_PART_NAME: C_RES_0402-A93548-210,RES,1,1%,0.0625W,TK0,GENERIC; CDS_LMAN_SYM_OUTLINE: -50,50,50,-50; FP_TECH: TK0; IP: GENERIC; ROOM: NONE; OriginalSymbolOrigin: (-75,25); XY: (2000,-75); ROT: 0; PHYS_PAGE: 172; LOCATION: R17303; DRAWING: @RVP1_ADL_SB_ADP_S_DDR5_SODIMM_2DPC_LIB.H55_DG2_2DPC(SCH_1):PAGE541; CDS_LIB: c_discrete; VARIANT: ?; PCB Footprint: CTK0_SM0402_1100X550_MA; VER: 1; CDS_PART_NAME: C_RES_0402-A93548-210,RES,1,1%,0.0625W,TK0,GENERIC; CDS_LOCATION: R17303
R17311 = C_RES: CDS_PHYS_PART_NAME: C_RES_0201-C80792-009,RES,0,5%,0.05W,TK0,GENERIC; CDS_LMAN_SYM_OUTLINE: -50,50,50,-50; FP_TECH: TK0; IP: GENERIC; ROOM: NONE; OriginalSymbolOrigin: (-25,75); XY: (-1250,1725); VER: 2; PHYS_PAGE: 172; LOCATION: R17311; DRAWING: @RVP1_ADL_SB_ADP_S_DDR5_SODIMM_2DPC_LIB.H55_DG2_2DPC(SCH_1):PAGE541; CDS_LIB: c_discrete; VARIANT: ?; PCB Footprint: CTK0_SM0201_630X330_MA; ROT: 0; CHIPS_PART_NAME: C_RES; CDS_PART_NAME: C_RES_0201-C80792-009,RES,0,5%,0.05W,TK0,GENERIC; CDS_LOCATION: R17311
R17312 = C_RES: CDS_PHYS_PART_NAME: C_RES_0201-C80792-009,RES,0,5%,0.05W,TK0,GENERIC; CDS_LMAN_SYM_OUTLINE: -50,50,50,-50; FP_TECH: TK0; IP: GENERIC; ROOM: NONE; OriginalSymbolOrigin: (-25,75); XY: (-1125,-575); VER: 2; PHYS_PAGE: 172; LOCATION: R17312; DRAWING: @RVP1_ADL_SB_ADP_S_DDR5_SODIMM_2DPC_LIB.H55_DG2_2DPC(SCH_1):PAGE541; CDS_LIB: c_discrete; VARIANT: ?; PCB Footprint: CTK0_SM0201_630X330_MA; ROT: 0; CHIPS_PART_NAME: C_RES; CDS_PART_NAME: C_RES_0201-C80792-009,RES,0,5%,0.05W,TK0,GENERIC; CDS_LOCATION: R17312
R17313 = C_RES#1: CHIPS_PART_NAME: C_RES; CDS_PHYS_PART_NAME: C_RES_0402-A93548-568,RES,2.2,1%,0.0625W,TK2,GENERIC; CDS_LMAN_SYM_OUTLINE: -50,50,50,-50; FP_TECH: TK2; IP: GENERIC; ROOM: NONE; OriginalSymbolOrigin: (-75,25); XY: (-725,475); VER: 1; ROT: 0; PHYS_PAGE: 172; LOCATION: R17313; DRAWING: @RVP1_ADL_SB_ADP_S_DDR5_SODIMM_2DPC_LIB.H55_DG2_2DPC(SCH_1):PAGE541; CDS_LIB: c_discrete; VARIANT: ?; PCB Footprint: CTK2_SM0402_1100X550_MA; CDS_PART_NAME: C_RES_0402-A93548-568,RES,2.2,1%,0.0625W,TK2,GENERIC; CDS_LOCATION: R17313